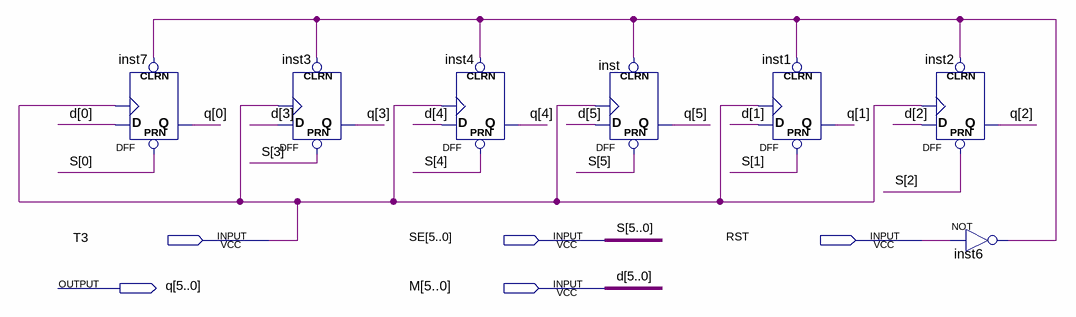
[diagram p0: schematic sheet]
// Quartus schematic uA_reg.bdf as structural Verilog: 7 symbols, 5 pins
module uA_reg (
  input  T3,
  input  [5:0] SE,
  input  RST,
  input  [5:0] M,
  output [5:0] q
);

  wire inst6_out;

  DFF inst7 (.CLRN(inst6_out), .CLK(T3), .D(M[0]), .PRN(SE[0]), .Q(q[0]));
  DFF inst3 (.CLRN(inst6_out), .CLK(T3), .D(M[3]), .PRN(SE[3]), .Q(q[3]));
  DFF inst4 (.CLRN(inst6_out), .CLK(T3), .D(M[4]), .PRN(SE[4]), .Q(q[4]));
  DFF inst (.CLRN(inst6_out), .CLK(T3), .D(M[5]), .PRN(SE[5]), .Q(q[5]));
  DFF inst1 (.CLRN(inst6_out), .CLK(T3), .D(M[1]), .PRN(SE[1]), .Q(q[1]));
  DFF inst2 (.CLRN(inst6_out), .CLK(T3), .D(M[2]), .PRN(SE[2]), .Q(q[2]));
  not inst6 (inst6_out, RST);

  // Other names for the same wires on the sheet: d[5:0] = M; S[5:0] = SE
endmodule
